# Altium schematic sheet PDM_MCU_Power.SchDoc
size A; SheetNumber: 4; SheetTotal: 4
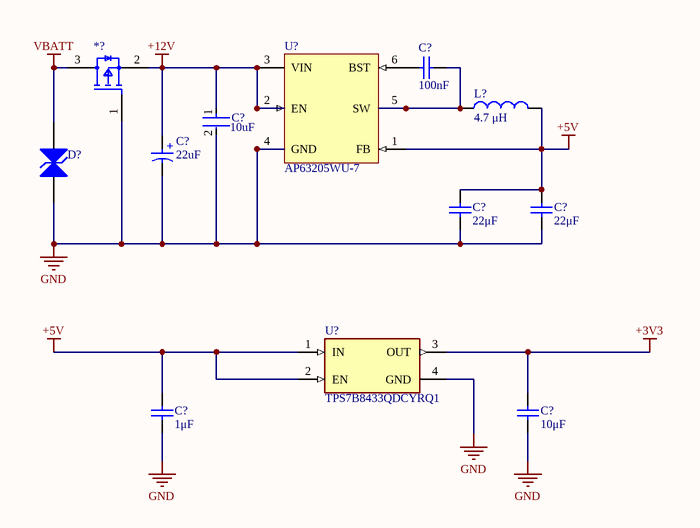
[diagram p0: PDM_MCU_Power.SchDoc]

## Parts
(Parts that share a designator on the sheet are numbered #1, #2 ... from top to bottom, then left to right.)
*?  DMP3099L-7  [SOT95P242X110-3N]  (value not drawn)
C?#1  value 100nF  (hidden comment: Capacitor)
C?#2  value 10uF  [FP-GRM188-0_2-IPC_C]  (hidden comment: GRM188R61E106KA73D)
C?#3  value 22uF  [WCAP-ASLI_D5H5.5]  (hidden comment: 865080442004)
C?#4  value 22μF  (hidden comment: Capacitor)
C?#5  value 22μF  (hidden comment: Capacitor)
C?#6  value 1μF  (hidden comment: Capacitor)
C?#7  value 10μF  (hidden comment: Capacitor)
D?  SMAJ13CA-E3/61  [VISH-DO-214AC-2_N]  (value not drawn)
L?  value 4.7 μH  (hidden comment: Inductor)
U?#1  AP63205WU-7  [FP-TSOT26-IPC_B]
U?#2  TPS7B8433QDCYRQ1  [FP-DCY0004A-MFG]

## Nets
+3V3: C?#7.1 U?#2.3(OUT)
+5V: C?#4.2 C?#5.2 C?#6.1 L?.2 U?#1.1(FB) U?#2.1(IN) U?#2.2(EN)
+12V: *?.2(Source) C?#2.1 C?#3.1(P) U?#1.2(EN) U?#1.3(VIN)
GND: *?.1(Gate) C?#2.2 C?#3.2(N) C?#4.1 C?#5.1 C?#6.2 C?#7.2 D?.1(A1) U?#1.4(GND) U?#2.4(GND)
VBATT: *?.3(Drain) D?.2(A2)
NetC?#1_1: C?#1.1 U?#1.6(BST)
NetC?#1_2: C?#1.2 L?.1 U?#1.5(SW)

## Notes on the sheet
- (in symbol CMP-00027-1) +

## Library data of the parts
*? = CMP-00025-2: Mosfet P-CH 30V 3.8A Vgs(ON) = -10V SOT23; Manufacturer 1: Diodes Incorporated; Manufacturer Part Number 1: DMP3099L-7; Digikey Part Number: DMP3099L-7DICT-ND
C?#1 C?#4-C?#7 = Capacitor: SimulationGenericComponent: True
C?#2 = CMP-00004-2: 10 uF, 25 V, ± 10%, X5R, 0603 [1608 Metric]; Voltage Rating: 25V; Material: Ceramic; Height: 1mm; Max Operating Temperature: 85°C; Thickness: 800um; Tolerance: 10%; Min Operating Temperature: -55°C; RoHS Compliant: Yes; Mounting Technology: Surface Mount; Voltage Rating (DC): 25V; Dielectric: X5R; Case/Package: 0603; Width: 800um; Series: GRM; Length: 1.6mm
C?#3 = CMP-00027-1: 22uF/25V Alum / For battery transients; Manufacturer 1: Würth Elektronik; Manufacturer Part Number 1: 865080442004
D? = CMP-0548-00189-2: Transient Voltage Suppressor, 6.40 to 231 V, 13 V Stand-off Voltage, Bi-Directional, -55 to 155 degC, 2-pin DO-214AC, Pb-Free, Tape and Reel; Manufacturer: Vishay Semiconductor; PPPM (W): 400, 300; VWM (V): 13; ID (uA): 2; IFSM: 40 A; VBR Bi-Directional (V): 6.4 to 231; Mounting Technology: Surface Mount; ComponentLink1Description: Manufacturer URL; ComponentLink3URL: http://www.vishay.com/docs/88390/smaj50a.pdf; PackageDescription: 2-Pin DO-214AC (SMA), Body 4.245 x 2.665 mm; Operating Junction and Storage Temperature Range: -55 to 150 degC; RoHS: TRUE; ComponentLink2URL: http://www.vishay.com/docs/88390/smaj50a.pdf; ComponentLink3Description: Package Specification; PartNumber: SMAJ13CA-E3/61; DatasheetVersion: 12/8/2013; PackageReference: DO-214AC-2; ComponentLink2Description: Datasheet; ComponentLink1URL: http://www.vishay.com/; Packing: Tape and Reel
L? = Inductor: SimulationGenericComponent: True
U?#1 = CMP-00003-5: AP63205 Series 32 V 2 A 1.1 MHz Synchronous Buck Converter -TSOT-26; Manufacturer 1: Diodes Incorporated; Manufacturer Part Number 1: AP63205WU-7; Digikey Part Number: AP63205WU-7DICT-ND
U?#2 = CMP-04917-000330-1: IC REG LIN 3.3V 150MA SOT223-4